# EAGLE design WT8266 (EAGLE 9.6.2)
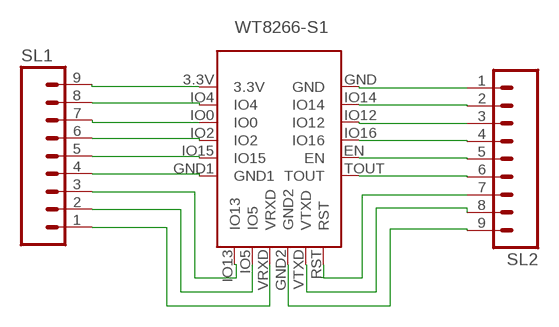
[diagram p0: schematic, sheet 1]

## Parts
SL1  MA09  [09PA]
SL2  MA09  [09PA]
U$1  WT8266-S1  [WT8266-S1]

## Nets
N$1: SL2.1 U$1.GND
N$2: SL2.2 U$1.IO14
N$3: SL2.3 U$1.IO12
N$4: SL2.4 U$1.IO16
N$5: SL2.5 U$1.EN
N$6: SL2.6 U$1.TOUT
N$7: SL2.7 U$1.RST
N$8: SL2.8 U$1.VTXD
N$9: SL2.9 U$1.GND2
N$10: SL1.9 U$1.3.3V
N$11: SL1.8 U$1.IO4
N$12: SL1.7 U$1.IO0
N$13: SL1.6 U$1.IO2
N$14: SL1.5 U$1.IO15
N$15: SL1.4 U$1.GND1
N$16: SL1.3 U$1.IO13
N$17: SL1.2 U$1.IO5
N$18: SL1.1 U$1.VRXD

## Library data of the parts
SL1 SL2 = con-amp-quick:MA09: AMP QUICK CONNECTOR; OC_FARNELL: unknown; OC_NEWARK: unknown
U$1 = WT8266:WT8266-S1

## Board
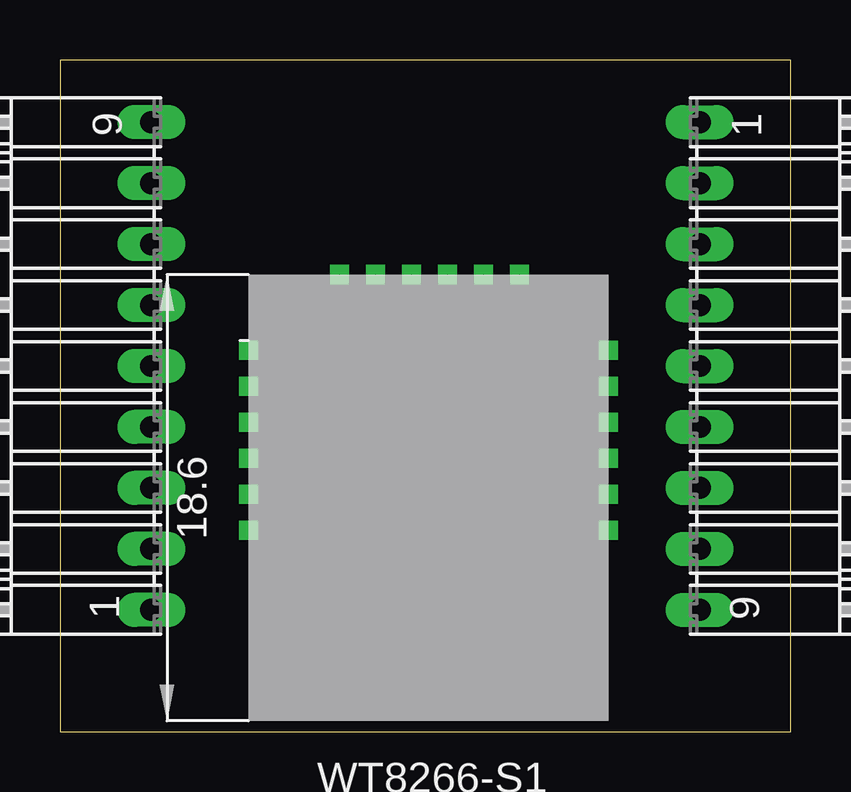
[diagram p1: board, top side]
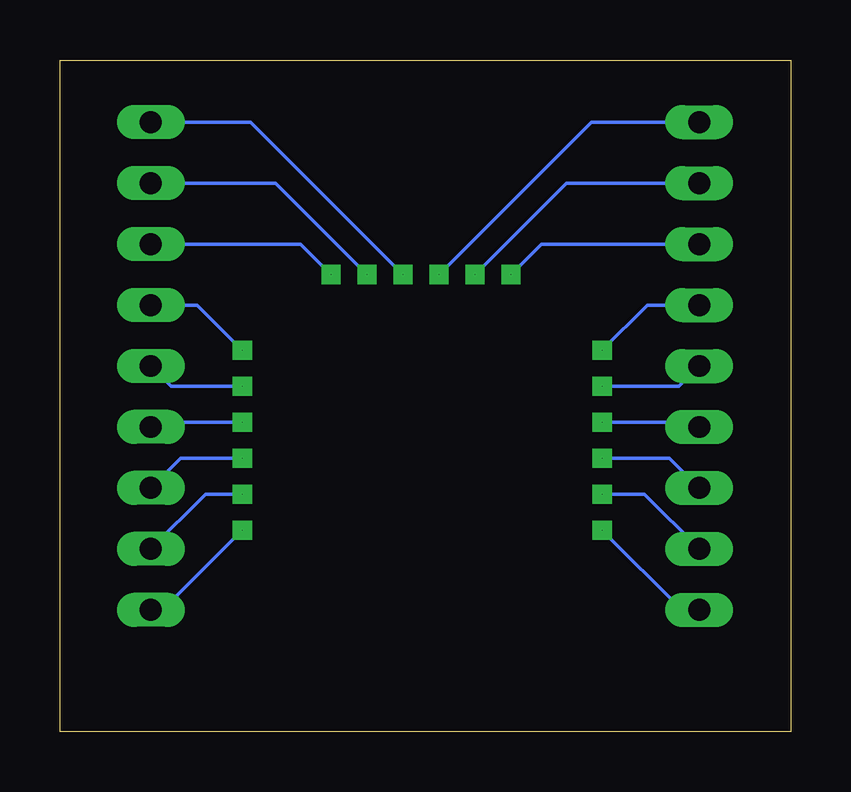
[diagram p2: board, bottom side, seen from below]

Size 30.46 x 27.99 mm. Coordinates in mm from the lower left corner, seen from the top.
Outline: 0,0 30.46,0 30.46,27.99 0,27.99 0,0
Copper layers (1*16): Top 0.035mm / dielectric 1.5mm / Bottom 0.035mm
Design rules "default": minimum track width 6mil, minimum drill 0.35mm, track to track 6mil, track to pad 6mil, pad to pad 6mil, via to via 6mil, smd to smd 6mil, copper to edge 40mil, drill to drill 6mil, minimum pad ring 10mil, minimum via ring 8mil, stop-mask expansion 4mil, vias tented up to drill 0mil, thermal gap 10mil

### Footprints (pad centres in the part's own frame; a part is rotated, then mirrored left to right if it is on the bottom)
09PA = drill 0.914 long: 1 -10.16,0; 2 -7.62,0; 3 -5.08,0; 4 -2.54,0; 5 0,0; 6 2.54,0; 7 5.08,0; 8 7.62,0; 9 10.16,0
WT8266-S1 = drill 0.01 pad 0.8 square: 3.3V 0,10.65; EN 15,4.65; GND 15,10.65; GND1 0,3.15; GND2 8.2,0; IO0 0,7.65; IO2 0,6.15; IO4 0,9.15; IO5 5.2,0; IO12 15,7.65; IO13 3.7,0; IO14 15,9.15; IO15 0,4.65; IO16 15,6.15; RST 11.2,0; TOUT 15,3.15; VRXD 6.7,0; VTXD 9.7,0

### Placement (x,y rotation side)
SL1  26.67,15.24 270 top
SL2  3.81,15.24 90 top
U$1  22.86,19.05 180 top

### Tracks (layer width: path | path; a pad name or v marks a point on that pad's centre or on a via)
N$1
  Bottom 0.152: U$1.GND 4.54,5.08 SL2.1
N$2
  Bottom 0.152: U$1.IO14 6.09,9.9 SL2.2
N$3
  Bottom 0.152: U$1.IO12 5.05,11.4 SL2.3
N$4
  Bottom 0.152: U$1.IO16 4.01,12.9 SL2.4
N$5
  Bottom 0.152: U$1.EN 4.65,14.4 SL2.5
N$6
  Bottom 0.152: U$1.TOUT 5.98,17.78 SL2.6
N$7
  Bottom 0.152: U$1.RST 10.39,20.32 SL2.7
N$8
  Bottom 0.152: U$1.VTXD 9.35,22.86 SL2.8
N$9
  Bottom 0.152: U$1.GND2 8.31,25.4 SL2.9
N$10
  Bottom 0.152: U$1.3.3V 26.18,5.08 SL1.9
N$11
  Bottom 0.152: U$1.IO4 24.39,9.9 SL1.8
N$12
  Bottom 0.152: U$1.IO0 25.43,11.4 SL1.7
N$13
  Bottom 0.152: 23.06,12.7 U$1.IO2 26.47,12.9 SL1.6
N$14
  Bottom 0.152: U$1.IO15 25.83,14.4 SL1.5
N$15
  Bottom 0.152: U$1.GND1 24.74,17.78 SL1.4
N$16
  Bottom 0.152: U$1.IO13 20.43,20.32 SL1.3
N$17
  Bottom 0.152: U$1.IO5 21.47,22.86 SL1.2
N$18
  Bottom 0.152: U$1.VRXD 22.51,25.4 SL1.1